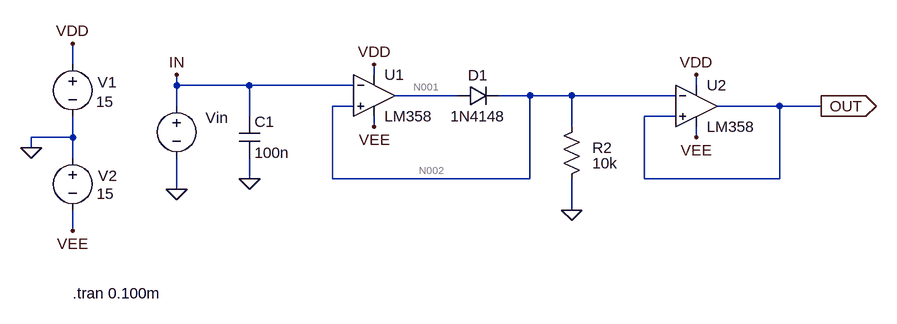
[diagram p0: schematic v1.0.asc]
v1.0.asc, the LTspice schematic file:
Version 4.1
SHEET 1 1772 700
WIRE 512 -1184 512 -1216
WIRE 976 -1168 976 -1184
WIRE 672 -1152 672 -1168
WIRE 784 -1152 672 -1152
WIRE 944 -1152 784 -1152
WIRE 1472 -1152 1472 -1168
WIRE 1104 -1136 1008 -1136
WIRE 1216 -1136 1168 -1136
WIRE 1280 -1136 1216 -1136
WIRE 1440 -1136 1280 -1136
WIRE 672 -1120 672 -1152
WIRE 944 -1120 912 -1120
WIRE 1600 -1120 1504 -1120
WIRE 1664 -1120 1600 -1120
WIRE 784 -1104 784 -1152
WIRE 1440 -1104 1392 -1104
WIRE 976 -1088 976 -1104
WIRE 1280 -1088 1280 -1136
WIRE 512 -1072 512 -1104
WIRE 512 -1072 448 -1072
WIRE 1472 -1072 1472 -1088
WIRE 448 -1056 448 -1072
WIRE 512 -1040 512 -1072
WIRE 784 -1008 784 -1040
WIRE 912 -1008 912 -1120
WIRE 1216 -1008 1216 -1136
WIRE 1216 -1008 912 -1008
WIRE 1392 -1008 1392 -1104
WIRE 1600 -1008 1600 -1120
WIRE 1600 -1008 1392 -1008
WIRE 672 -992 672 -1040
WIRE 1280 -960 1280 -1008
WIRE 512 -928 512 -960
FLAG 512 -1216 VDD
FLAG 448 -1056 0
FLAG 1664 -1120 OUT
IOPIN 1664 -1120 Out
FLAG 976 -1088 VEE
FLAG 512 -928 VEE
FLAG 976 -1184 VDD
FLAG 672 -992 0
FLAG 1472 -1072 VEE
FLAG 1472 -1168 VDD
FLAG 672 -1168 IN
FLAG 784 -1008 0
FLAG 1280 -960 0
SYMBOL voltage 512 -1200 R0
WINDOW 123 0 0 Left 2
WINDOW 39 0 0 Left 2
WINDOW 0 38 43 Left 2
WINDOW 3 36 73 Left 2
SYMATTR InstName V1
SYMATTR Value 15
SYMBOL voltage 672 -1136 M0
WINDOW 123 24 146 Left 2
WINDOW 39 24 125 Left 2
WINDOW 0 -79 34 Left 2
WINDOW 3 -256 58 Invisible 2
SYMATTR InstName Vin
SYMATTR Value SINE(0V 1V 10KH)
SYMBOL res 1264 -992 M180
WINDOW 0 48 64 Left 2
WINDOW 3 48 40 Left 2
SYMATTR InstName R2
SYMATTR Value 10k
SYMBOL voltage 512 -1056 R0
WINDOW 123 24 146 Left 2
WINDOW 39 24 125 Left 2
WINDOW 0 39 43 Left 2
WINDOW 3 37 71 Left 2
SYMATTR InstName V2
SYMATTR Value 15
SYMBOL MyLib\\OpAmp\\LM358 976 -1200 R0
SYMATTR InstName U1
SYMBOL MyLib\\OpAmp\\LM358 1472 -1184 R0
SYMATTR InstName U2
SYMBOL cap 768 -1104 R0
SYMATTR InstName C1
SYMATTR Value 100n
SYMBOL diode 1104 -1120 R270
WINDOW 0 32 32 VTop 2
WINDOW 3 0 32 VBottom 2
SYMATTR InstName D1
SYMATTR Value 1N4148
TEXT 512 -832 Left 2 !.tran 0.100m

The netlist it stands for:
* v1.0.asc
V1 VDD 0 15
Vin IN 0 SINE(0V 1V 10KH)
R2 0 N002 10k
V2 0 VEE 15
* U1: LM358 (symbol MyLib\OpAmp\LM358 not available, pins judged from their places): In+=N002 In-=IN V+=VDD V-=VEE OUT=N001
* U2: LM358 (symbol MyLib\OpAmp\LM358 not available, pins judged from their places): In+=OUT In-=N002 V+=VDD V-=VEE OUT=OUT
C1 IN 0 100n
D1 N001 N002 1N4148
.model D D
.lib standard.dio
.tran 0.100m
.backanno
.end

* Results of the author's LTspice run, read from the files saved beside the schematic
* Operating Point, zero values left out:
*   V(n001) = -14.78 V
*   V(n002) = 174.4 µV
*   V(out) = 174.4 µV
*   V(vdd) = 15 V
*   V(vee) = -15 V
*   I(D1) = -2.535 nA
*   I(R2) = -17.44 nA
*   I(V1) = -692.3 µA
*   I(V2) = -692.2 µA
*   I(Vin) = 27.47 nA
*   Ix(u1:1) = -9.973 nA
*   Ix(u1:2) = -10.03 nA
*   Ix(u1:3) = 2.535 nA
*   Ix(u1:4) = 348.2 µA
*   Ix(u1:5) = -348.1 µA
*   Ix(u2:1) = -10 nA
*   Ix(u2:2) = -10 nA
*   Ix(u2:3) = 10 nA
*   Ix(u2:4) = 344.1 µA
*   Ix(u2:5) = -344.1 µA